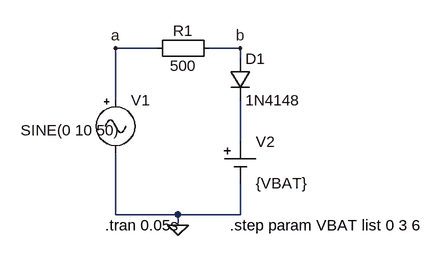
[diagram p0: schematic clipper_diod_pos.asc]
clipper_diod_pos.asc, the LTspice schematic file:
Version 4
SHEET 1 880 680
WIRE 16 128 -48 128
WIRE 144 128 96 128
WIRE 144 144 144 128
WIRE -48 208 -48 128
WIRE 144 272 144 208
WIRE -48 384 -48 288
WIRE 48 384 -48 384
WIRE 144 384 144 336
WIRE 144 384 48 384
WIRE 48 400 48 384
FLAG -48 128 a
FLAG 144 128 b
FLAG 48 400 0
SYMBOL diode 128 144 R0
SYMATTR InstName D1
SYMATTR Value 1N4148
SYMBOL Misc\\signal -48 192 R0
WINDOW 123 0 0 Left 2
WINDOW 39 0 0 Left 2
WINDOW 3 -146 62 Left 2
SYMATTR Value SINE(0 10 50)
SYMATTR InstName V1
SYMBOL Misc\\EuropeanResistor 112 112 R90
WINDOW 0 5 56 VBottom 2
WINDOW 3 27 56 VTop 2
SYMATTR InstName R1
SYMATTR Value 500
SYMBOL Misc\\cell 144 272 R0
WINDOW 123 0 0 Left 0
WINDOW 39 0 0 Left 0
SYMATTR InstName V2
SYMATTR Value {VBAT}
TEXT -64 400 Left 2 !.tran 0.05s
TEXT 128 400 Left 2 !.step param VBAT list 0 3 6

The netlist it stands for:
* clipper_diod_pos.asc
D1 b N001 1N4148
V1 a 0 SINE(0 10 50)
R1 b a 500
V2 N001 0 {VBAT}
.model D D
.lib standard.dio
.tran 0.05s
.step param VBAT list 0 3 6
.backanno
.end